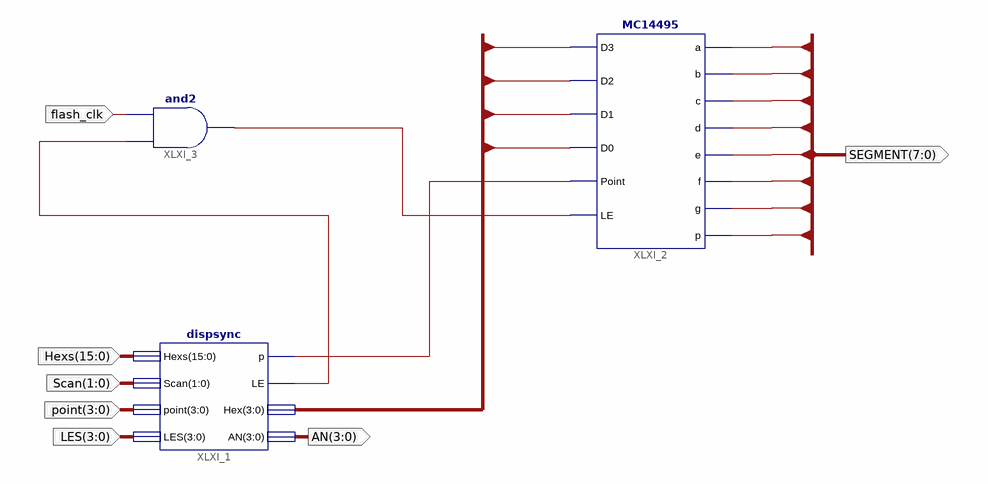
[diagram p0: schematic sheet 1]
// Xilinx ISE schematic Seg7_Dev16.sch (kintex7) as structural Verilog: 3 symbols, 7 ports
module Seg7_Dev16 (
  input  [15:0] Hexs,
  input  [1:0] Scan,
  input  [3:0] point,
  input  [3:0] LES,
  input  flash_clk,
  output [3:0] AN,
  output [7:0] SEGMENT
);

  wire XLXN_6, XLXN_8, XLXN_11;
  wire [3:0] Hex;

  dispsync XLXI_1 (.Hexs(Hexs), .Scan(Scan), .point(point), .LES(LES), .p(XLXN_6), .LE(XLXN_8), .Hex(Hex), .AN(AN));
  MC14495 XLXI_2 (
    .D3(Hex[3]), .D2(Hex[2]), .D1(Hex[1]), .D0(Hex[0]), .Point(XLXN_6), .LE(XLXN_11), .a(SEGMENT[0]),
    .b(SEGMENT[1]), .c(SEGMENT[2]), .d(SEGMENT[3]), .e(SEGMENT[4]), .f(SEGMENT[5]), .g(SEGMENT[6]),
    .p(SEGMENT[7]));
  and XLXI_3 (XLXN_11, XLXN_8, flash_clk);
endmodule
